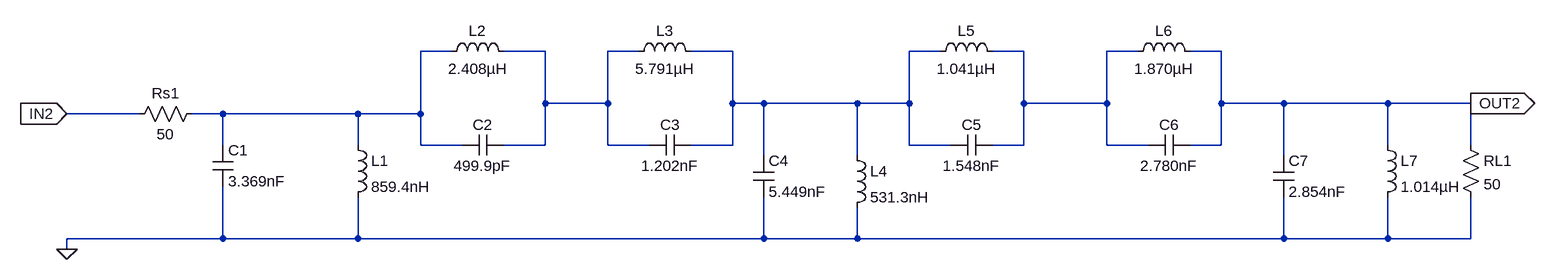
[diagram p0: schematic BPF2.asc]
BPF2.asc, the LTspice schematic file:
Version 4
SHEET 1 1388 680
WIRE -304 -48 -352 -48
WIRE -160 -48 -224 -48
WIRE -16 -48 -64 -48
WIRE 128 -48 64 -48
WIRE 448 -48 400 -48
WIRE 576 -48 528 -48
WIRE 752 -48 704 -48
WIRE 880 -48 832 -48
WIRE -160 32 -160 -48
WIRE -64 32 -64 -48
WIRE -64 32 -160 32
WIRE 128 32 128 -48
WIRE 176 32 128 32
WIRE 320 32 176 32
WIRE 400 32 400 -48
WIRE 400 32 320 32
WIRE 576 32 576 -48
WIRE 704 32 704 -48
WIRE 704 32 576 32
WIRE 880 32 880 -48
WIRE 976 32 880 32
WIRE 1136 32 976 32
WIRE 1264 32 1136 32
WIRE -784 48 -896 48
WIRE -656 48 -704 48
WIRE -448 48 -656 48
WIRE -352 48 -352 -48
WIRE -352 48 -448 48
WIRE -656 96 -656 48
WIRE -448 96 -448 48
WIRE -352 96 -352 48
WIRE -288 96 -352 96
WIRE -160 96 -160 32
WIRE -160 96 -224 96
WIRE -64 96 -64 32
WIRE 0 96 -64 96
WIRE 128 96 128 32
WIRE 128 96 64 96
WIRE 400 96 400 32
WIRE 464 96 400 96
WIRE 576 96 576 32
WIRE 576 96 528 96
WIRE 704 96 704 32
WIRE 768 96 704 96
WIRE 880 96 880 32
WIRE 880 96 832 96
WIRE 1136 96 1136 32
WIRE 1264 96 1264 32
WIRE 176 112 176 32
WIRE 320 112 320 32
WIRE 976 112 976 32
WIRE -656 240 -656 160
WIRE -656 240 -896 240
WIRE -448 240 -448 176
WIRE -448 240 -656 240
WIRE 176 240 176 176
WIRE 176 240 -448 240
WIRE 320 240 320 192
WIRE 320 240 176 240
WIRE 976 240 976 176
WIRE 976 240 320 240
WIRE 1136 240 1136 176
WIRE 1136 240 976 240
WIRE 1264 240 1264 176
WIRE 1264 240 1136 240
WIRE -896 256 -896 240
FLAG -896 256 0
FLAG 1264 32 OUT2
IOPIN 1264 32 Out
FLAG -896 48 IN2
IOPIN -896 48 In
SYMBOL res -688 32 R90
WINDOW 0 0 56 VBottom 2
WINDOW 3 32 56 VTop 2
SYMATTR InstName Rs1
SYMATTR Value 50
SYMBOL cap -672 96 R0
SYMATTR InstName C1
SYMATTR Value 3.369nF
SYMBOL ind -464 80 R0
SYMATTR InstName L1
SYMATTR Value 859.4nH
SYMBOL ind -320 -32 R270
WINDOW 0 32 56 VTop 2
WINDOW 3 5 56 VBottom 2
SYMATTR InstName L2
SYMATTR Value 2.408µH
SYMBOL cap -224 80 R90
WINDOW 0 0 32 VBottom 2
WINDOW 3 32 32 VTop 2
SYMATTR InstName C2
SYMATTR Value 499.9pF
SYMBOL ind -32 -32 R270
WINDOW 0 32 56 VTop 2
WINDOW 3 5 56 VBottom 2
SYMATTR InstName L3
SYMATTR Value 5.791µH
SYMBOL cap 0 112 R270
WINDOW 0 32 32 VTop 2
WINDOW 3 0 32 VBottom 2
SYMATTR InstName C3
SYMATTR Value 1.202nF
SYMBOL cap 160 112 R0
SYMATTR InstName C4
SYMATTR Value 5.449nF
SYMBOL ind 304 96 R0
SYMATTR InstName L4
SYMATTR Value 531.3nH
SYMBOL ind 432 -32 R270
WINDOW 0 32 56 VTop 2
WINDOW 3 5 56 VBottom 2
SYMATTR InstName L5
SYMATTR Value 1.041µH
SYMBOL cap 528 80 R90
WINDOW 0 0 32 VBottom 2
WINDOW 3 32 32 VTop 2
SYMATTR InstName C5
SYMATTR Value 1.548nF
SYMBOL ind 736 -32 R270
WINDOW 0 32 56 VTop 2
WINDOW 3 5 56 VBottom 2
SYMATTR InstName L6
SYMATTR Value 1.870µH
SYMBOL cap 768 112 R270
WINDOW 0 32 32 VTop 2
WINDOW 3 0 32 VBottom 2
SYMATTR InstName C6
SYMATTR Value 2.780nF
SYMBOL cap 960 112 R0
SYMATTR InstName C7
SYMATTR Value 2.854nF
SYMBOL ind 1120 80 R0
SYMATTR InstName L7
SYMATTR Value 1.014µH
SYMBOL res 1248 80 R0
SYMATTR InstName RL1
SYMATTR Value 50

The netlist it stands for:
* BPF2.asc
Rs1 N001 IN2 50
C1 N001 0 3.369nF
L1 N001 0 859.4nH
L2 N001 N002 2.408µH
C2 N002 N001 499.9pF
L3 N002 N003 5.791µH
C3 N002 N003 1.202nF
C4 N003 0 5.449nF
L4 N003 0 531.3nH
L5 N003 N004 1.041µH
C5 N004 N003 1.548nF
L6 N004 OUT2 1.870µH
C6 N004 OUT2 2.780nF
C7 OUT2 0 2.854nF
L7 OUT2 0 1.014µH
RL1 OUT2 0 50
.backanno
.end